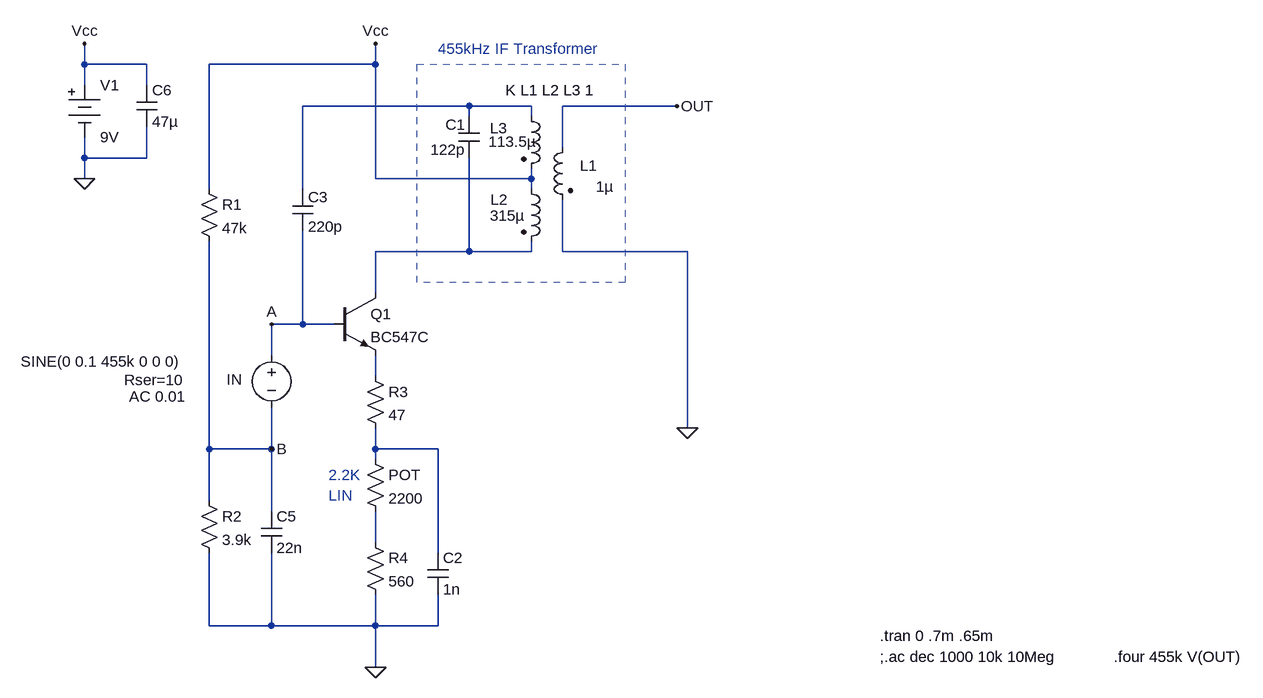
[diagram p0: schematic transistor-IF-stage.asc]
transistor-IF-stage.asc, the LTspice schematic file:
Version 4.1
SHEET 1 1288 1052
WIRE -512 0 -512 -32
WIRE -416 0 -512 0
WIRE -64 0 -64 -32
WIRE -64 0 -320 0
WIRE -512 32 -512 0
WIRE -416 32 -416 0
WIRE 80 64 -176 64
WIRE 176 64 80 64
WIRE 400 64 224 64
WIRE 80 80 80 64
WIRE 176 80 176 64
WIRE 224 128 224 64
WIRE -512 144 -512 112
WIRE -416 144 -416 96
WIRE -416 144 -512 144
WIRE -512 176 -512 144
WIRE -64 176 -64 0
WIRE 176 176 176 160
WIRE 176 176 -64 176
WIRE -320 192 -320 0
WIRE -176 192 -176 64
WIRE 176 192 176 176
WIRE 80 288 80 144
WIRE 80 288 -64 288
WIRE 176 288 176 272
WIRE 176 288 80 288
WIRE 224 288 224 208
WIRE 416 288 224 288
WIRE -64 352 -64 288
WIRE -176 400 -176 256
WIRE -176 400 -224 400
WIRE -128 400 -176 400
WIRE -224 448 -224 400
WIRE -64 480 -64 448
WIRE 416 560 416 288
WIRE -320 592 -320 272
WIRE -224 592 -224 528
WIRE -224 592 -320 592
WIRE -64 592 -64 560
WIRE 32 592 -64 592
WIRE -64 608 -64 592
WIRE -320 672 -320 592
WIRE -224 688 -224 592
WIRE -64 736 -64 688
WIRE 32 752 32 592
WIRE -320 864 -320 752
WIRE -224 864 -224 752
WIRE -224 864 -320 864
WIRE -64 864 -64 816
WIRE -64 864 -224 864
WIRE 32 864 32 816
WIRE 32 864 -64 864
WIRE -64 928 -64 864
FLAG -64 928 0
FLAG -64 -32 Vcc
FLAG 416 560 0
FLAG -512 -32 Vcc
FLAG -512 176 0
FLAG 400 64 OUT
FLAG -224 400 A
FLAG -224 592 B
SYMBOL ind2 240 112 M0
WINDOW 0 -38 44 Left 2
WINDOW 3 -62 76 Left 2
SYMATTR InstName L1
SYMATTR Value 1µ
SYMATTR SpiceLine Rser=0.3
SYMBOL ind2 160 176 R0
WINDOW 0 -47 32 Left 2
WINDOW 3 -48 57 Left 2
SYMATTR InstName L2
SYMATTR Value 315µ
SYMATTR SpiceLine Rser=20
SYMBOL ind2 160 64 R0
WINDOW 0 -48 34 Left 2
WINDOW 3 -50 55 Left 2
SYMATTR InstName L3
SYMATTR Value 113.5µ
SYMATTR SpiceLine Rser=16
SYMBOL cap 64 80 R0
WINDOW 0 -20 13 Left 2
WINDOW 3 -43 51 Left 2
SYMATTR InstName C1
SYMATTR Value 122p
SYMBOL npn -128 352 R0
SYMATTR InstName Q1
SYMATTR Value BC547C
SYMBOL res -80 720 R0
SYMATTR InstName R4
SYMATTR Value 560
SYMBOL cap 16 752 R0
SYMATTR InstName C2
SYMATTR Value 1n
SYMBOL cap -192 192 R0
WINDOW 0 24 12 Left 2
WINDOW 3 24 58 Left 2
SYMATTR InstName C3
SYMATTR Value 220p
SYMBOL res -336 176 R0
SYMATTR InstName R1
SYMATTR Value 47k
SYMBOL res -336 656 R0
SYMATTR InstName R2
SYMATTR Value 3.9k
SYMBOL voltage -224 432 R0
WINDOW 0 -69 53 Left 2
WINDOW 3 -386 25 Left 2
WINDOW 123 -219 79 Left 2
WINDOW 39 -227 54 Left 2
SYMATTR InstName IN
SYMATTR Value SINE(0 0.1 455k 0 0 0)
SYMATTR Value2 AC 0.01
SYMATTR SpiceLine Rser=10
SYMBOL Misc\\battery -512 16 R0
SYMATTR InstName V1
SYMATTR Value 9V
SYMBOL cap -240 688 R0
SYMATTR InstName C5
SYMATTR Value 22n
SYMBOL cap -432 32 R0
SYMATTR InstName C6
SYMATTR Value 47µ
SYMBOL res -80 464 R0
SYMATTR InstName R3
SYMATTR Value 47
SYMBOL res -80 592 R0
SYMATTR InstName POT
SYMATTR Value 2200
TEXT 136 40 Left 2 !K L1 L2 L3 1
TEXT 712 880 Left 2 !.tran 0 .7m .65m
TEXT 712 912 Left 2 !;.ac dec 1000 10k 10Meg
TEXT 32 -24 Left 2 ;455kHz IF Transformer
TEXT 1072 912 Left 2 !.four 455k V(OUT)
TEXT -136 632 Left 2 ;2.2K\nLIN
RECTANGLE Normal 320 336 0 0 2

The netlist it stands for:
* transistor-IF-stage.asc
L1 OUT 0 1µ Rser=0.3
L2 Vcc N002 315µ Rser=20
L3 N001 Vcc 113.5µ Rser=16
C1 N001 N002 122p
Q1 N002 A N003 0 BC547C
R4 N005 0 560
C2 N004 0 1n
C3 N001 A 220p
R1 Vcc B 47k
R2 B 0 3.9k
V§IN A B SINE(0 0.1 455k 0 0 0) AC 0.01 Rser=10
V1 Vcc 0 9V
C5 B 0 22n
C6 Vcc 0 47µ
R3 N003 N004 47
R§POT N004 N005 2200
.model NPN NPN
.model PNP PNP
.lib standard.bjt
K L1 L2 L3 1
.tran 0 .7m .65m
;.ac dec 1000 10k 10Meg
* 455kHz IF Transformer
.four 455k V(OUT)
* 2.2K
* LIN
.backanno
.end